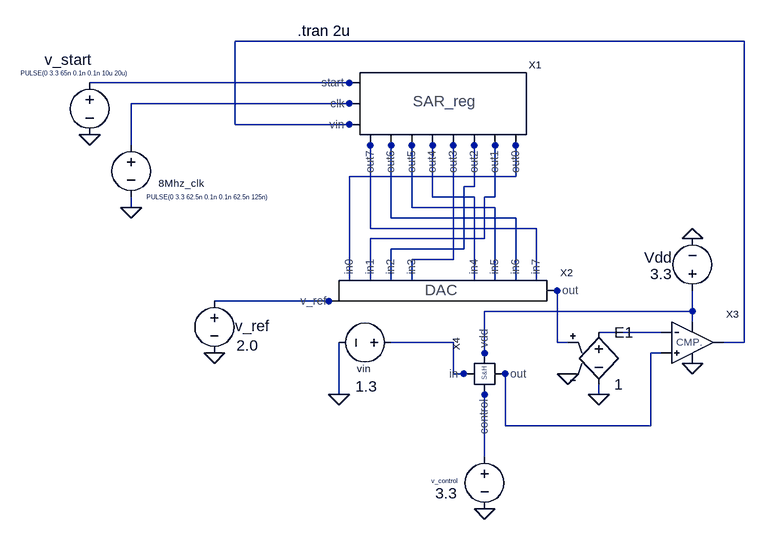
[diagram p0: schematic Draft8.asc]
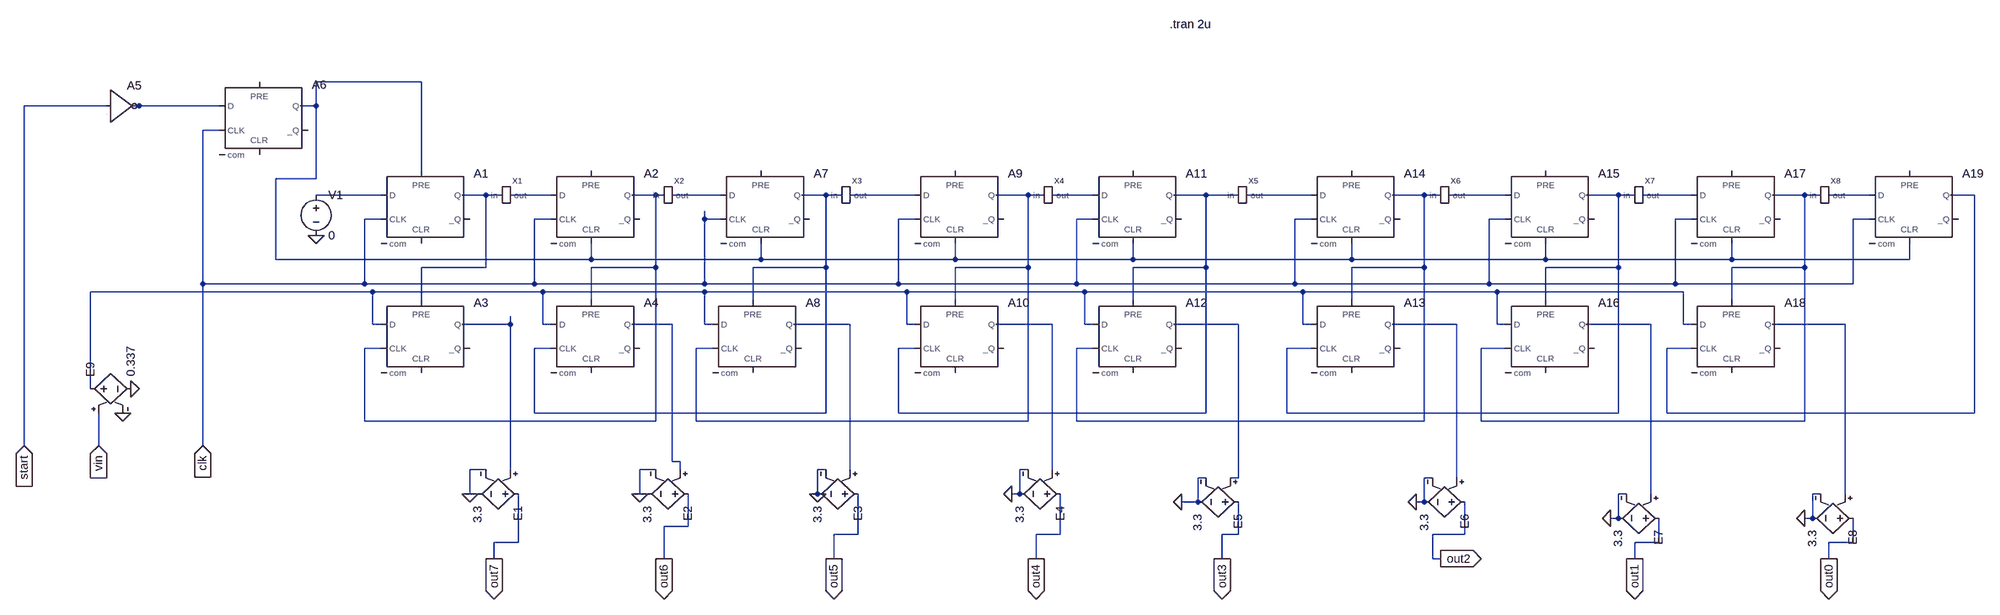
[diagram p1: sub-circuit sar_logic.asc]
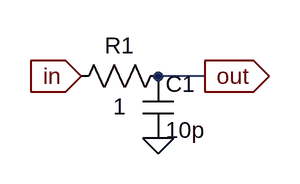
[diagram p2: sub-circuit rc_delay.asc]
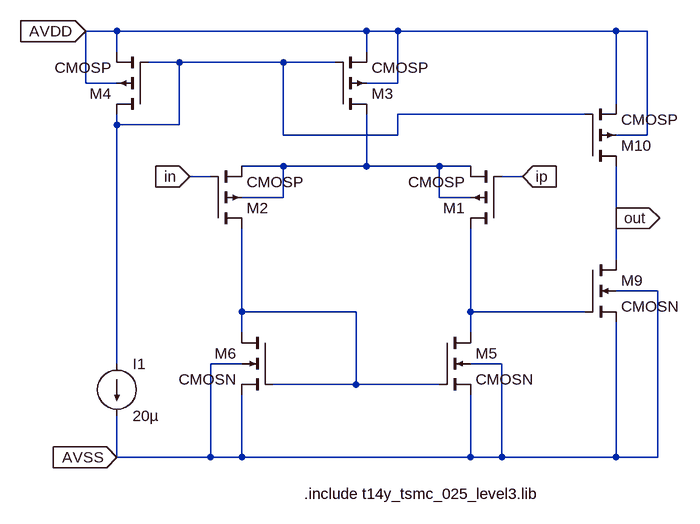
[diagram p3: sub-circuit comparator.asc]
Draft8.asc, the LTspice schematic file:
Version 4
SHEET 1 880 756
WIRE 720 0 -64 0
WIRE 112 64 -288 64
WIRE 128 64 112 64
WIRE 112 96 -224 96
WIRE 128 96 112 96
WIRE -64 128 -64 0
WIRE 112 128 -64 128
WIRE 128 128 112 128
WIRE -224 160 -224 96
WIRE 144 160 144 144
WIRE 176 160 176 144
WIRE 208 160 208 144
WIRE 240 160 240 144
WIRE 272 160 272 144
WIRE 304 160 304 144
WIRE 336 160 336 144
WIRE 368 160 368 144
WIRE 368 208 368 160
WIRE 368 208 112 208
WIRE 304 224 304 160
WIRE 304 224 288 224
WIRE 240 240 240 160
WIRE 304 240 240 240
WIRE 336 240 336 160
WIRE 336 240 320 240
WIRE -224 256 -224 240
WIRE 208 256 208 160
WIRE 336 256 208 256
WIRE 176 272 176 160
WIRE 368 272 176 272
WIRE 144 288 144 160
WIRE 400 288 144 288
WIRE 320 304 320 240
WIRE 320 304 144 304
WIRE 288 320 288 224
WIRE 288 320 176 320
WIRE 272 336 272 160
WIRE 272 336 208 336
WIRE 112 368 112 208
WIRE 144 368 144 304
WIRE 176 368 176 320
WIRE 208 368 208 336
WIRE 304 368 304 240
WIRE 336 368 336 256
WIRE 368 368 368 272
WIRE 400 368 400 288
WIRE 432 384 416 384
WIRE 80 400 -96 400
WIRE 96 400 80 400
WIRE 640 416 640 384
WIRE 640 416 320 416
WIRE 640 432 640 416
WIRE 592 448 496 448
WIRE 272 464 176 464
WIRE 432 464 432 384
WIRE 448 464 432 464
WIRE 720 464 720 0
WIRE 720 464 688 464
WIRE 320 480 320 416
WIRE 592 480 576 480
WIRE 320 496 320 480
WIRE 272 512 272 464
WIRE 288 512 272 512
WIRE 304 512 288 512
WIRE 352 512 336 512
WIRE 96 544 96 464
WIRE 320 544 320 528
WIRE 496 544 496 528
WIRE 352 592 352 512
WIRE 576 592 576 480
WIRE 576 592 352 592
WIRE 320 640 320 544
FLAG -96 480 0
FLAG -224 256 0
FLAG 640 496 0
FLAG 96 544 0
FLAG -288 144 0
FLAG 640 304 0
FLAG 320 720 0
FLAG 448 512 0
FLAG 496 544 0
SYMBOL sar_logic 240 96 R0
SYMATTR InstName X1
SYMBOL comparator 608 432 R0
SYMATTR InstName X3
SYMBOL SH_ckt 320 512 R270
SYMATTR InstName X4
SYMBOL voltage -96 384 R0
WINDOW 123 0 0 Left 0
WINDOW 39 0 0 Left 0
WINDOW 0 32 54 Left 2
WINDOW 3 34 84 Left 2
SYMATTR InstName v_ref
SYMATTR Value 2.0
SYMBOL voltage -224 144 R0
WINDOW 0 42 74 Left 1
WINDOW 3 24 96 Left 0
WINDOW 123 0 0 Left 0
WINDOW 39 0 0 Left 0
SYMATTR InstName 8Mhz_clk
SYMATTR Value PULSE(0 3.3 62.5n 0.1n 0.1n 62.5n 125n)
SYMBOL voltage -288 48 R0
WINDOW 3 -106 1 Left 0
WINDOW 123 0 0 Left 0
WINDOW 39 0 0 Left 0
WINDOW 0 -69 -20 Left 2
SYMATTR Value PULSE(0 3.3 65n 0.1n 0.1n 10u 20u)
SYMATTR InstName v_start
SYMBOL voltage 192 464 R90
WINDOW 0 50 58 VBottom 1
WINDOW 3 52 54 VTop 2
WINDOW 123 0 0 Left 0
WINDOW 39 0 0 Left 0
SYMATTR InstName vin
SYMATTR Value 1.3
SYMBOL voltage 640 400 R180
WINDOW 0 31 67 Left 2
WINDOW 3 31 42 Left 2
WINDOW 123 0 0 Left 0
WINDOW 39 0 0 Left 0
SYMATTR InstName Vdd
SYMATTR Value 3.3
SYMBOL voltage 320 624 R0
WINDOW 123 0 0 Left 0
WINDOW 39 0 0 Left 0
WINDOW 0 -82 53 Left 0
WINDOW 3 -76 72 Left 2
SYMATTR InstName v_control
SYMATTR Value 3.3
SYMBOL e 496 432 R0
SYMATTR InstName E1
SYMATTR Value 1
SYMBOL dac_ckt 192 384 R0
SYMATTR InstName X2
TEXT 32 -16 Left 2 !.tran 2u

sar_logic.asc, the sub-circuit schematic file:
Version 4
SHEET 1 3220 1104
WIRE 144 48 -64 48
WIRE -480 96 -688 96
WIRE -416 96 -432 96
WIRE -256 96 -416 96
WIRE -64 96 -64 48
WIRE -64 96 -96 96
WIRE -256 144 -288 144
WIRE 144 224 144 48
WIRE -64 240 -64 96
WIRE -64 240 -144 240
WIRE 64 272 -64 272
WIRE 272 272 224 272
WIRE 304 272 272 272
WIRE 400 272 320 272
WIRE 608 272 560 272
WIRE 624 272 608 272
WIRE 736 272 640 272
WIRE 944 272 896 272
WIRE 976 272 944 272
WIRE 1120 272 992 272
WIRE 1344 272 1280 272
WIRE 1376 272 1344 272
WIRE 1472 272 1392 272
WIRE 1696 272 1632 272
WIRE 1760 272 1696 272
WIRE 1904 272 1776 272
WIRE 2128 272 2064 272
WIRE 2160 272 2128 272
WIRE 2288 272 2176 272
WIRE 2512 272 2448 272
WIRE 2544 272 2512 272
WIRE 2656 272 2560 272
WIRE 2880 272 2816 272
WIRE 2912 272 2880 272
WIRE 3008 272 2928 272
WIRE 3216 272 3168 272
WIRE 64 320 32 320
WIRE 400 320 368 320
WIRE 704 320 704 304
WIRE 736 320 704 320
WIRE 1120 320 1088 320
WIRE 1472 320 1440 320
WIRE 1904 320 1872 320
WIRE 2288 320 2256 320
WIRE 2656 320 2624 320
WIRE 3008 320 2976 320
WIRE -144 400 -144 240
WIRE 480 400 480 368
WIRE 480 400 -144 400
WIRE 816 400 816 368
WIRE 816 400 480 400
WIRE 1200 400 1200 368
WIRE 1200 400 816 400
WIRE 1552 400 1552 368
WIRE 1552 400 1200 400
WIRE 1984 400 1984 368
WIRE 1984 400 1552 400
WIRE 2368 400 2368 368
WIRE 2368 400 1984 400
WIRE 2736 400 2736 368
WIRE 2736 400 2368 400
WIRE 3088 400 3088 368
WIRE 3088 400 2736 400
WIRE 272 416 272 272
WIRE 272 416 144 416
WIRE 608 416 608 272
WIRE 608 416 480 416
WIRE 944 416 944 272
WIRE 944 416 800 416
WIRE 1344 416 1344 272
WIRE 1344 416 1200 416
WIRE 1696 416 1696 272
WIRE 1696 416 1552 416
WIRE 2128 416 2128 272
WIRE 2128 416 1984 416
WIRE 2512 416 2512 272
WIRE 2512 416 2368 416
WIRE 2880 416 2880 272
WIRE 2880 416 2736 416
WIRE -288 448 -288 144
WIRE 32 448 32 320
WIRE 32 448 -288 448
WIRE 368 448 368 320
WIRE 368 448 32 448
WIRE 704 448 704 320
WIRE 704 448 368 448
WIRE 1088 448 1088 320
WIRE 1088 448 704 448
WIRE 1440 448 1440 320
WIRE 1440 448 1088 448
WIRE 1872 448 1872 320
WIRE 1872 448 1440 448
WIRE 2256 448 2256 320
WIRE 2256 448 1872 448
WIRE 2624 448 2624 320
WIRE 2624 448 2256 448
WIRE 2976 448 2976 320
WIRE 2976 448 2624 448
WIRE 48 464 -512 464
WIRE 384 464 48 464
WIRE 704 464 384 464
WIRE 1104 464 704 464
WIRE 1456 464 1104 464
WIRE 1888 464 1456 464
WIRE 2272 464 1888 464
WIRE 2640 464 2272 464
WIRE 144 480 144 416
WIRE 480 480 480 416
WIRE 800 480 800 416
WIRE 1200 480 1200 416
WIRE 1552 480 1552 416
WIRE 1984 480 1984 416
WIRE 2368 480 2368 416
WIRE 2736 480 2736 416
WIRE 48 528 48 464
WIRE 64 528 48 528
WIRE 320 528 320 512
WIRE 320 528 224 528
WIRE 384 528 384 464
WIRE 400 528 384 528
WIRE 640 528 560 528
WIRE 704 528 704 464
WIRE 720 528 704 528
WIRE 992 528 880 528
WIRE 1104 528 1104 464
WIRE 1120 528 1104 528
WIRE 1392 528 1280 528
WIRE 1456 528 1456 464
WIRE 1472 528 1456 528
WIRE 1760 528 1632 528
WIRE 1888 528 1888 464
WIRE 1904 528 1888 528
WIRE 2192 528 2064 528
WIRE 2272 528 2272 464
WIRE 2288 528 2272 528
WIRE 2576 528 2448 528
WIRE 2640 528 2640 464
WIRE 2656 528 2640 528
WIRE 2960 528 2816 528
WIRE 64 576 32 576
WIRE 400 576 368 576
WIRE 720 576 688 576
WIRE 1120 576 1088 576
WIRE 1472 576 1440 576
WIRE 1904 576 1856 576
WIRE 2288 576 2240 576
WIRE 2656 576 2608 576
WIRE -512 656 -512 464
WIRE 368 704 368 576
WIRE 944 704 944 416
WIRE 944 704 368 704
WIRE 1088 704 1088 576
WIRE 1696 704 1696 416
WIRE 1696 704 1088 704
WIRE 1856 704 1856 576
WIRE 2512 704 2512 416
WIRE 2512 704 1856 704
WIRE 2608 704 2608 576
WIRE 3216 704 3216 272
WIRE 3216 704 2608 704
WIRE 32 720 32 576
WIRE 608 720 608 416
WIRE 608 720 32 720
WIRE 688 720 688 576
WIRE 1344 720 1344 416
WIRE 1344 720 688 720
WIRE 1440 720 1440 576
WIRE 2128 720 2128 416
WIRE 2128 720 1440 720
WIRE 2240 720 2240 576
WIRE 2880 720 2880 416
WIRE 2880 720 2240 720
WIRE -688 768 -688 96
WIRE -496 768 -496 704
WIRE -288 768 -288 448
WIRE 640 800 640 528
WIRE 656 800 640 800
WIRE 272 816 240 816
WIRE 320 816 320 528
WIRE 608 816 576 816
WIRE 656 816 656 800
WIRE 944 816 928 816
WIRE 992 816 992 528
WIRE 1344 816 1328 816
WIRE 1392 816 1392 528
WIRE 1696 832 1680 832
WIRE 1760 832 1760 528
WIRE 1760 832 1744 832
WIRE 2144 832 2128 832
WIRE 2192 832 2192 528
WIRE 240 864 240 816
WIRE 256 864 240 864
WIRE 576 864 576 816
WIRE 592 864 576 864
WIRE 928 864 928 816
WIRE 928 864 912 864
WIRE 1328 864 1328 816
WIRE 1328 864 1312 864
WIRE 2528 864 2512 864
WIRE 2576 864 2576 528
WIRE 2912 864 2896 864
WIRE 2960 864 2960 528
WIRE 1680 880 1680 832
WIRE 1680 880 1648 880
WIRE 2128 880 2128 832
WIRE 2128 880 2112 880
WIRE 2512 912 2512 864
WIRE 2512 912 2496 912
WIRE 2896 912 2896 864
WIRE 2896 912 2880 912
WIRE 672 928 672 864
WIRE 672 928 624 928
WIRE 1008 944 1008 864
WIRE 1008 944 960 944
WIRE 1408 944 1408 864
WIRE 1408 944 1360 944
WIRE 1760 944 1760 880
WIRE 1760 944 1728 944
WIRE 2208 944 2208 880
WIRE 2208 944 2144 944
WIRE 336 960 336 864
WIRE 336 960 288 960
WIRE 2592 960 2592 912
WIRE 2592 960 2544 960
WIRE 2976 960 2976 912
WIRE 2976 960 2928 960
WIRE 288 992 288 960
WIRE 624 992 624 928
WIRE 960 992 960 944
WIRE 1360 992 1360 944
WIRE 1728 992 1728 944
WIRE 2144 992 2144 944
WIRE 2160 992 2144 992
WIRE 2544 992 2544 960
WIRE 2928 992 2928 960
FLAG -64 352 0
FLAG 2928 992 out0
IOPIN 2928 992 Out
FLAG 2544 992 out1
IOPIN 2544 992 Out
FLAG 2160 992 out2
IOPIN 2160 992 Out
FLAG 1728 992 out3
IOPIN 1728 992 Out
FLAG 1360 992 out4
IOPIN 1360 992 Out
FLAG 960 992 out5
IOPIN 960 992 Out
FLAG 624 992 out6
IOPIN 624 992 Out
FLAG 288 992 out7
IOPIN 288 992 Out
FLAG 2880 912 0
FLAG 2496 912 0
FLAG 2112 880 0
FLAG 1312 864 0
FLAG 928 864 0
FLAG 576 864 0
FLAG 240 864 0
FLAG 1648 880 0
FLAG -688 768 start
IOPIN -688 768 In
FLAG -496 768 vin
IOPIN -496 768 In
FLAG -288 768 clk
IOPIN -288 768 In
FLAG -448 704 0
FLAG -432 656 0
SYMBOL Digital\\dflop 144 224 R0
SYMATTR InstName A1
SYMBOL Digital\\dflop 480 224 R0
SYMATTR InstName A2
SYMBOL Digital\\dflop 144 480 R0
SYMATTR InstName A3
SYMBOL Digital\\dflop 480 480 R0
SYMATTR InstName A4
SYMBOL voltage -64 256 R0
WINDOW 123 0 0 Left 0
WINDOW 39 0 0 Left 0
SYMATTR InstName V1
SYMATTR Value 0
SYMBOL Digital\\inv -480 32 R0
SYMATTR InstName A5
SYMBOL Digital\\dflop -176 48 R0
SYMATTR InstName A6
SYMBOL rc_delay 304 256 R0
SYMATTR InstName X1
SYMBOL Digital\\dflop 816 224 R0
SYMATTR InstName A7
SYMBOL rc_delay 624 256 R0
SYMATTR InstName X2
SYMBOL Digital\\dflop 800 480 R0
SYMATTR InstName A8
SYMBOL Digital\\dflop 1200 224 R0
SYMATTR InstName A9
SYMBOL Digital\\dflop 1200 480 R0
SYMATTR InstName A10
SYMBOL Digital\\dflop 1552 224 R0
SYMATTR InstName A11
SYMBOL rc_delay 976 256 R0
SYMATTR InstName X3
SYMBOL rc_delay 1376 256 R0
SYMATTR InstName X4
SYMBOL Digital\\dflop 1552 480 R0
SYMATTR InstName A12
SYMBOL Digital\\dflop 1984 480 R0
SYMATTR InstName A13
SYMBOL Digital\\dflop 1984 224 R0
SYMATTR InstName A14
SYMBOL Digital\\dflop 2368 224 R0
SYMATTR InstName A15
SYMBOL Digital\\dflop 2368 480 R0
SYMATTR InstName A16
SYMBOL Digital\\dflop 2736 224 R0
SYMATTR InstName A17
SYMBOL Digital\\dflop 2736 480 R0
SYMATTR InstName A18
SYMBOL Digital\\dflop 3088 224 R0
SYMATTR InstName A19
SYMBOL rc_delay 1760 256 R0
SYMATTR InstName X5
SYMBOL rc_delay 2160 256 R0
SYMATTR InstName X6
SYMBOL rc_delay 2544 256 R0
SYMATTR InstName X7
SYMBOL rc_delay 2912 256 R0
SYMATTR InstName X8
SYMBOL e 352 864 R90
SYMATTR InstName E1
SYMATTR Value 3.3
SYMBOL e 688 864 R90
SYMATTR InstName E2
SYMATTR Value 3.3
SYMBOL e 1024 864 R90
SYMATTR InstName E3
SYMATTR Value 3.3
SYMBOL e 1424 864 R90
SYMATTR InstName E4
SYMATTR Value 3.3
SYMBOL e 1776 880 R90
SYMATTR InstName E5
SYMATTR Value 3.3
SYMBOL e 2224 880 R90
SYMATTR InstName E6
SYMATTR Value 3.3
SYMBOL e 2608 912 R90
SYMATTR InstName E7
SYMATTR Value 3.3
SYMBOL e 2992 912 R90
SYMATTR InstName E8
SYMATTR Value 3.3
SYMBOL e -528 656 R270
SYMATTR InstName E9
SYMATTR Value 0.337
TEXT 1624 -88 Left 2 !.tran 2u

rc_delay.asc, the sub-circuit schematic file:
Version 4
SHEET 1 880 680
WIRE 272 160 224 160
FLAG 144 160 in
IOPIN 144 160 In
FLAG 272 160 out
IOPIN 272 160 Out
FLAG 224 224 0
SYMBOL res 240 144 R90
WINDOW 0 0 56 VBottom 2
WINDOW 3 32 56 VTop 2
SYMATTR InstName R1
SYMATTR Value 1
SYMBOL cap 208 160 R0
SYMATTR InstName C1
SYMATTR Value 10p

comparator.asc, the sub-circuit schematic file:
Version 4
SHEET 1 3688 680
WIRE -160 -336 -208 -336
WIRE 224 -336 -160 -336
WIRE 272 -336 224 -336
WIRE 608 -336 272 -336
WIRE 656 -336 608 -336
WIRE -160 -304 -160 -336
WIRE 224 -304 224 -336
WIRE -64 -288 -112 -288
WIRE 96 -288 -64 -288
WIRE 176 -288 96 -288
WIRE -208 -256 -208 -336
WIRE -160 -256 -208 -256
WIRE 272 -256 272 -336
WIRE 272 -256 224 -256
WIRE 608 -224 608 -336
WIRE 560 -208 272 -208
WIRE -160 -192 -160 -208
WIRE -64 -192 -64 -288
WIRE -64 -192 -160 -192
WIRE 96 -176 96 -288
WIRE 272 -176 272 -208
WIRE 272 -176 96 -176
WIRE 656 -176 656 -336
WIRE 656 -176 608 -176
WIRE 96 -128 32 -128
WIRE 224 -128 224 -208
WIRE 224 -128 96 -128
WIRE 336 -128 224 -128
WIRE 384 -128 336 -128
WIRE -16 -112 -48 -112
WIRE 464 -112 432 -112
WIRE 96 -80 96 -128
WIRE 96 -80 32 -80
WIRE 336 -80 336 -128
WIRE 384 -80 336 -80
WIRE 608 -48 608 -128
WIRE 608 16 608 -48
WIRE 672 64 608 64
WIRE 32 96 32 -32
WIRE 208 96 32 96
WIRE 384 96 384 -32
WIRE 560 96 384 96
WIRE 32 128 32 96
WIRE 384 128 384 96
WIRE -160 176 -160 -192
WIRE 32 176 -16 176
WIRE 432 176 384 176
WIRE 208 208 208 96
WIRE 208 208 80 208
WIRE 336 208 208 208
WIRE -160 320 -160 256
WIRE -16 320 -16 176
WIRE -16 320 -160 320
WIRE 32 320 32 224
WIRE 32 320 -16 320
WIRE 384 320 384 224
WIRE 384 320 32 320
WIRE 432 320 432 176
WIRE 432 320 384 320
WIRE 608 320 608 112
WIRE 608 320 432 320
WIRE 672 320 672 64
WIRE 672 320 608 320
FLAG 464 -112 ip
IOPIN 464 -112 In
FLAG -48 -112 in
IOPIN -48 -112 In
FLAG 608 -48 out
IOPIN 608 -48 Out
FLAG -208 -336 AVDD
IOPIN -208 -336 In
FLAG -160 320 AVSS
IOPIN -160 320 In
SYMBOL cmosp 176 -208 M180
SYMATTR InstName M3
SYMATTR Value2 l=0.7u w=1.6u
SYMBOL cmosp -112 -208 R180
SYMATTR InstName M4
SYMATTR Value2 l=0.7u w=1.6u
SYMBOL cmosn 336 128 R0
SYMATTR InstName M5
SYMATTR Value2 l=1u w=2.7u m=1
SYMBOL cmosn 80 128 M0
SYMATTR InstName M6
SYMATTR Value2 l=1u w=2.7u m=1
SYMBOL cmosp 432 -32 R180
SYMATTR InstName M1
SYMATTR Value2 l=0.7u w=5u m=1
SYMBOL cmosp -16 -32 M180
SYMATTR InstName M2
SYMATTR Value2 l=0.7u w=5u m=1
SYMBOL cmosn 560 16 R0
SYMATTR InstName M9
SYMATTR Value2 l=0.925u w=1.225u m=1
SYMBOL cmosp 560 -128 M180
SYMATTR InstName M10
SYMATTR Value2 l=0.95u w=0.575u m=1
SYMBOL current -160 176 R0
WINDOW 123 0 0 Left 0
WINDOW 39 0 0 Left 0
SYMATTR InstName I1
SYMATTR Value 20µ
TEXT 128 376 Left 2 !.include t14y_tsmc_025_level3.lib

The netlist it stands for:
* Draft8.asc
XX1 N002 N003 N001 N011 N010 N009 N008 N007 N006 N005 N004 sar_logic
XX3 N015 N017 N014 0 N001 comparator
XX4 N016 N018 N017 N014 SH_ckt  ; pins in control out vdd
v_ref N013 0 2.0
V§8Mhz_clk N003 0 PULSE(0 3.3 62.5n 0.1n 0.1n 62.5n 125n)
v_start N002 0 PULSE(0 3.3 65n 0.1n 0.1n 10u 20u)
vin N016 0 1.3
Vdd N014 0 3.3
v_control N018 0 3.3
E1 N015 0 N012 0 1
XX2 N012 N004 N013 N011 N010 N009 N008 N007 N006 N005 dac_ckt  ; pins out in7 v_ref in0 in1 in2 in3 in4 in5 in6

* block symbol definitions
.subckt sar_logic start clk vin out0 out1 out2 out3 out4 out5 out6 out7
A1 N003 0 clk N001 0 0 N004 0 DFLOP
A2 N005 0 clk 0 N001 0 N006 0 DFLOP
A3 N021 0 N006 N004 0 0 N022 0 DFLOP
A4 N021 0 N008 N006 0 0 N023 0 DFLOP
V1 N003 0 0
A5 start 0 0 0 0 N002 0 0 BUF
A6 N002 0 clk 0 0 0 N001 0 DFLOP
XX1 N004 N005 rc_delay
A7 N007 0 clk 0 N001 0 N008 0 DFLOP
XX2 N006 N007 rc_delay
A8 N021 0 N010 N008 0 0 N024 0 DFLOP
A9 N009 0 clk 0 N001 0 N010 0 DFLOP
A10 N021 0 N012 N010 0 0 N025 0 DFLOP
A11 N011 0 clk 0 N001 0 N012 0 DFLOP
XX3 N008 N009 rc_delay
XX4 N010 N011 rc_delay
A12 N021 0 N014 N012 0 0 N026 0 DFLOP
A13 N021 0 N016 N014 0 0 N027 0 DFLOP
A14 N013 0 clk 0 N001 0 N014 0 DFLOP
A15 N015 0 clk 0 N001 0 N016 0 DFLOP
A16 N021 0 N018 N016 0 0 N028 0 DFLOP
A17 N017 0 clk 0 N001 0 N018 0 DFLOP
A18 N021 0 N020 N018 0 0 N029 0 DFLOP
A19 N019 0 clk 0 N001 0 N020 0 DFLOP
XX5 N012 N013 rc_delay
XX6 N014 N015 rc_delay
XX7 N016 N017 rc_delay
XX8 N018 N019 rc_delay
E1 out7 0 N022 0 3.3
E2 out6 0 N023 0 3.3
E3 out5 0 N024 0 3.3
E4 out4 0 N025 0 3.3
E5 out3 0 N026 0 3.3
E6 out2 0 N027 0 3.3
E7 out1 0 N028 0 3.3
E8 out0 0 N029 0 3.3
E9 N021 0 vin 0 0.337
.tran 2u
.ends sar_logic

.subckt rc_delay in out
R1 out in 1
C1 out 0 10p
.ends rc_delay

.subckt comparator in ip AVDD AVSS out
M3 N002 N001 AVDD AVDD CMOSP l=0.7u w=1.6u
M4 N001 N001 AVDD AVDD CMOSP l=0.7u w=1.6u
M5 N004 N003 AVSS AVSS CMOSN l=1u w=2.7u m=1
M6 N003 N003 AVSS AVSS CMOSN l=1u w=2.7u m=1
M1 N004 ip N002 N002 CMOSP l=0.7u w=5u m=1
M2 N003 in N002 N002 CMOSP l=0.7u w=5u m=1
M9 out N004 AVSS AVSS CMOSN l=0.925u w=1.225u m=1
M10 out N001 AVDD AVDD CMOSP l=0.95u w=0.575u m=1
I1 N001 AVSS 20µ
.include t14y_tsmc_025_level3.lib
.ends comparator

.model NMOS NMOS
.model PMOS PMOS
.lib standard.mos
.tran 2u
.backanno
.end